# Altium project URESP_PULSER.PrjPcb
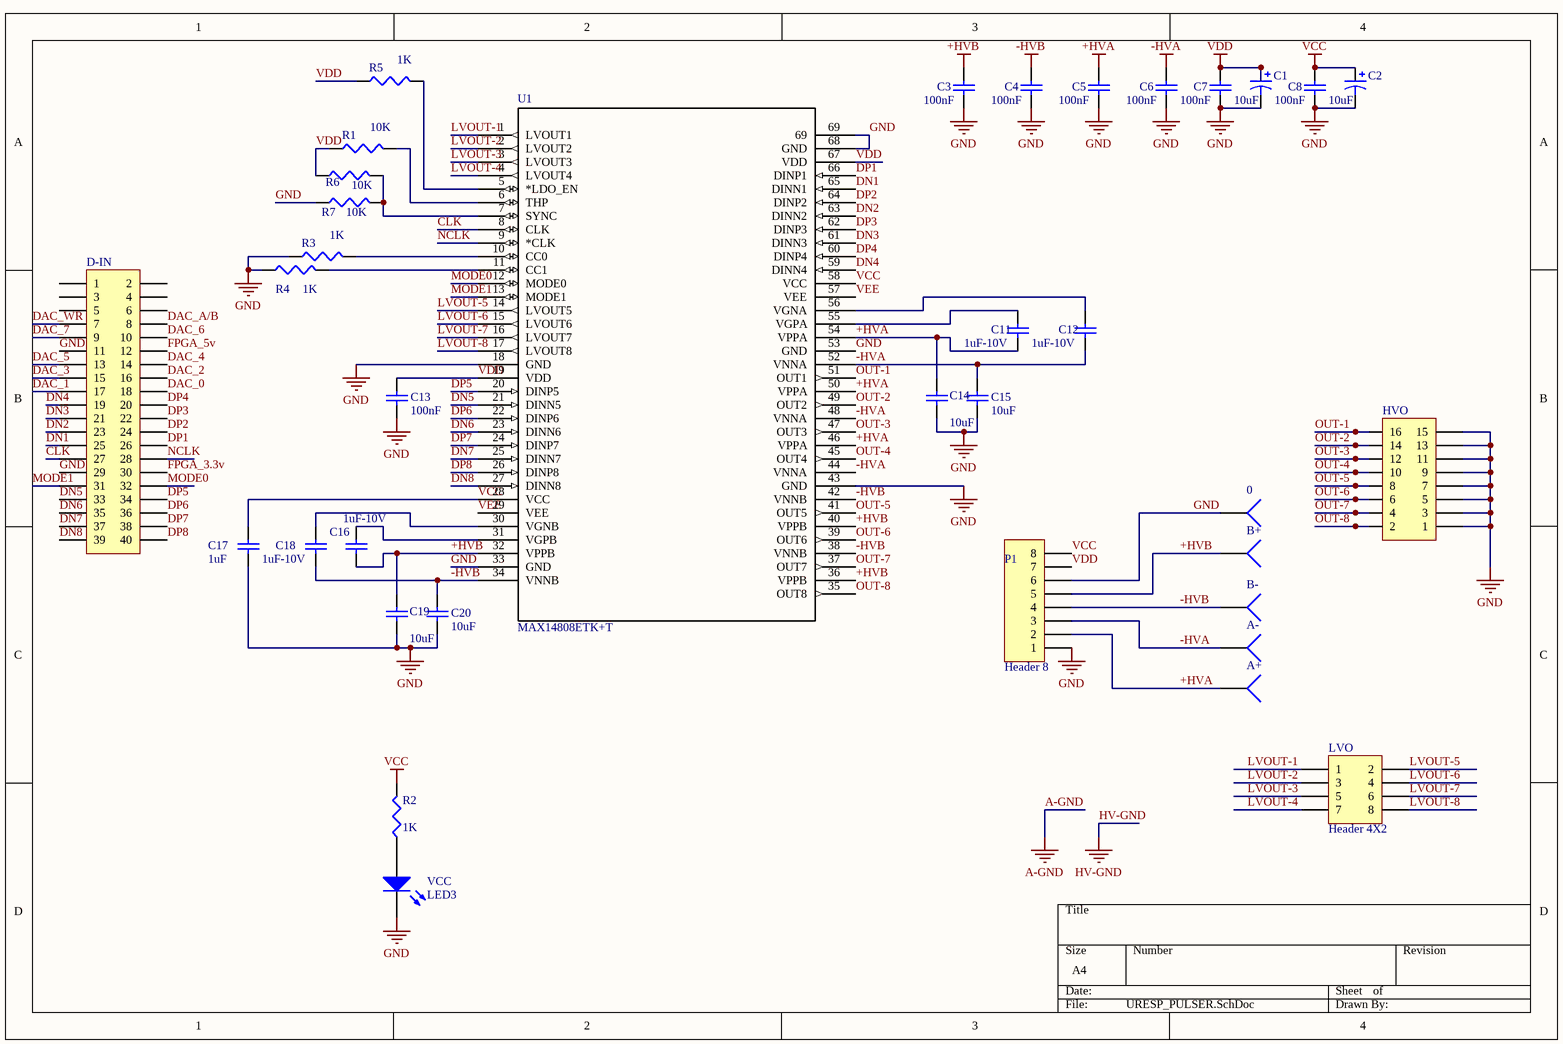
[diagram p0: URESP_PULSER.SchDoc]
2 sheets, 54 parts. Net scope: global (net labels, ports and power ports of the same name join across sheets).
Board file: URESP_PULSER.PcbDoc
Sheets:
  URESP_PULSER.SchDoc
  URESP_PULSER_2.SchDoc

## Sheet URESP_PULSER.SchDoc
size A4

### Parts
0  (no value)  [PIN1]
A+  (no value)  [PIN1]
A-  (no value)  [PIN1]
B+  (no value)  [PIN1]
B-  (no value)  [PIN1]
C1  value 10uF  [C1206]
C2  value 10uF  [C1206]
C3  value 100nF  [6-0805_M]
C4  value 100nF  [6-0805_M]
C5  value 100nF  [6-0805_M]
C6  value 100nF  [6-0805_M]
C7  value 100nF  [1608[0603]]
C8  value 100nF  [1608[0603]]
C11  value 1uF-10V  [1608[0603]]
C12  value 1uF-10V  [1608[0603]]
C13  value 100nF  [1608[0603]]
C14  value 10uF  [CAPPR5-6.3X5]
C15  value 10uF  [CAPPR5-6.3x5]
C16  value 1uF-10V  [1608[0603]]
C17  value 1uF  [1608[0603]]
C18  value 1uF-10V  [1608[0603]]
C19  value 10uF  [CAPPR5-6.3X5]
C20  value 10uF  [CAPPR5-6.3X5]
D-IN  (no value)  [HDR2X20]
HVO  (no value)  [HDR2X8]
LVO  Header 4X2  [HDR2X4]
P1  Header 8  [HDR1X8]
R1  value 10K  [J1-0603]
R2  value 1K  [J1-0603]
R3  value 1K  [J1-0603]
R4  value 1K  [J1-0603]
R5  value 1K  [J1-0603]
R6  value 10K  [J1-0603]
R7  value 10K  [J1-0603]
U1  MAX14808ETK+T  [21-0142E_T6800-2]
VCC  LED3  [6-0805_M]

### Nets
+HVA: A+.1 C5.2 C11.1 C14.1 P1.2 U1.46(VPPA) U1.50(VPPA) U1.54(VPPA)
+HVB: B+.1 C3.2 C16.1 C19.1 P1.5 U1.32(VPPB) U1.36(VPPB) U1.40(VPPB)
-HVA: A-.1 C6.2 C12.1 C15.2 P1.3 U1.44(VNNA) U1.48(VNNA) U1.52(VNNA)
-HVB: B-.1 C4.2 C18.1 C20.2 P1.4 U1.34(VNNB) U1.38(VNNB) U1.42(VNNB)
GND: 0.1 C1.2 C2.2 C3.1 C4.1 C5.1 C6.1 C7.1 C8.1 C13.1 C14.2 C15.1 C17.1 C19.2 C20.1 D-IN.11 D-IN.29 HVO.1 HVO.3 HVO.5 HVO.7 HVO.9 HVO.11 HVO.13 HVO.15 P1.1 P1.6 R3.1 R4.1 R7.1 U1.18(GND) U1.33(GND) U1.43(GND) U1.53(GND) U1.68(GND) U1.69 VCC.2(K)
VCC: C2.1 C8.2 C17.2 P1.8 R2.2 U1.28(VCC) U1.58(VCC)
VDD: C1.1 C7.2 C13.2 P1.7 R1.1 R5.1 R6.1 U1.19(VDD) U1.67(VDD)
CLK: D-IN.27 U1.8(CLK)
DAC_0: D-IN.18
DAC_1: D-IN.17
DAC_2: D-IN.16
DAC_3: D-IN.15
DAC_4: D-IN.14
DAC_5: D-IN.13
DAC_6: D-IN.10
DAC_7: D-IN.9
DAC_A/B: D-IN.8
DAC_WR: D-IN.7
DN1: D-IN.25 U1.65(DINN1)
DN2: D-IN.23 U1.63(DINN2)
DN3: D-IN.21 U1.61(DINN3)
DN4: D-IN.19 U1.59(DINN4)
DN5: D-IN.33 U1.21(DINN5)
DN6: D-IN.35 U1.23(DINN6)
DN7: D-IN.37 U1.25(DINN7)
DN8: D-IN.39 U1.27(DINN8)
DP1: D-IN.26 U1.66(DINP1)
DP2: D-IN.24 U1.64(DINP2)
DP3: D-IN.22 U1.62(DINP3)
DP4: D-IN.20 U1.60(DINP4)
DP5: D-IN.34 U1.20(DINP5)
DP6: D-IN.36 U1.22(DINP6)
DP7: D-IN.38 U1.24(DINP7)
DP8: D-IN.40 U1.26(DINP8)
FPGA_3.3v: D-IN.30
FPGA_5v: D-IN.12
LVOUT-1: LVO.1 U1.1(LVOUT1)
LVOUT-2: LVO.3 U1.2(LVOUT2)
LVOUT-3: LVO.5 U1.3(LVOUT3)
LVOUT-4: LVO.7 U1.4(LVOUT4)
LVOUT-5: LVO.2 U1.14(LVOUT5)
LVOUT-6: LVO.4 U1.15(LVOUT6)
LVOUT-7: LVO.6 U1.16(LVOUT7)
LVOUT-8: LVO.8 U1.17(LVOUT8)
MODE0: D-IN.32 U1.12(MODE0)
MODE1: D-IN.31 U1.13(MODE1)
NCLK: D-IN.28 U1.9(*CLK)
OUT-1: HVO.16 U1.51(OUT1)
OUT-2: HVO.14 U1.49(OUT2)
OUT-3: HVO.12 U1.47(OUT3)
OUT-4: HVO.10 U1.45(OUT4)
OUT-5: HVO.8 U1.41(OUT5)
OUT-6: HVO.6 U1.39(OUT6)
OUT-7: HVO.4 U1.37(OUT7)
OUT-8: HVO.2 U1.35(OUT8)
VEE: U1.29(VEE) U1.57(VEE)
NetC11_2: C11.2 U1.55(VGPA)
NetC12_2: C12.2 U1.56(VGNA)
NetC16_2: C16.2 U1.31(VGPB)
NetC18_2: C18.2 U1.30(VGNB)
NetR1_2: R1.2 U1.6(THP)
NetR2_1: R2.1 VCC.1(A)
NetR3_2: R3.2 U1.10(CC0)
NetR4_2: R4.2 U1.11(CC1)
NetR5_2: R5.2 U1.5(*LDO_EN)
NetR6_2: R6.2 R7.2 U1.7(SYNC)

Not connected (* = marked no-connect by the designer): D-IN 1 2 3 4 5 6

### Library data of the parts
0 A+ A- B+ B- = Socket: LatestRevisionDate: 17-Jul-2002; LatestRevisionNote: Re-released for DXP Platform.; Publisher: Altium Limited
C1 C2 = Cap Pol3: Polarized Capacitor (Surface Mount); Published: 8-Jun-2000; LatestRevisionDate: 29-May-2009; LatestRevisionNote: IPC-7351 Footprint Added.; PackageReference: C0805; Publisher: Altium Limited; PackageDescription: Chip Capacitor
C3-C8 C11-C20 = Cap Semi: Capacitor (Semiconductor SIM Model); Published: 8-Jun-2000; LatestRevisionDate: 29-May-2009; LatestRevisionNote: IPC-7351 Footprint Added.; PackageReference: C1206; Publisher: Altium Limited; PackageDescription: Chip Capacitor
D-IN = Header 20X2: Header, 20-Pin, Dual row; LatestRevisionDate: 17-Jul-2002; LatestRevisionNote: Re-released for DXP Platform.; Publisher: Altium Limited
HVO = Header 8X2H: Header, 8-Pin, Dual row, Right Angle; LatestRevisionDate: 17-Jul-2002; LatestRevisionNote: Re-released for DXP Platform.; Publisher: Altium Limited
LVO = Header 4X2: Header, 4-Pin, Dual row; LatestRevisionDate: 17-Jul-2002; LatestRevisionNote: Re-released for DXP Platform.; Publisher: Altium Limited
P1 = Header 8: Header, 8-Pin; LatestRevisionDate: 17-Jul-2002; LatestRevisionNote: Re-released for DXP Platform.; Publisher: Altium Limited
R1-R7 = Res3: Resistor; Published: 8-Jun-2000; LatestRevisionDate: 29-May-2009; LatestRevisionNote: IPC-7351 Footprint Added.; PackageReference: J1-0603; Publisher: Altium Limited; PackageDescription: Chip Resistor
U1 = MAX14808ETK+T: Imported; Vendor: Maxim; Manufacturer_Part_Number: MAX14808ETK+T; Manufacturer_Name: Maxim; RefDes: RefDes; Type: DEV; Value: Value
VCC = LED3: Typical BLUE SiC LED; Published: 8-Jun-2000; LatestRevisionDate: 17-Dec-2003; LatestRevisionNote: PCB Footprint replaced.; DatasheetVersion: 16-Apr-2002; PackageVersion: 16-Apr-2002; PackageReference: 3.5X2.8X1.9; Publisher: Altium Limited; PackageDescription: SM LED; 2 C-Bend Leads; Body 3.5 x 2.8 x 1.9 mm, inc leads (LxWxH typ)

## Sheet URESP_PULSER_2.SchDoc
size A4
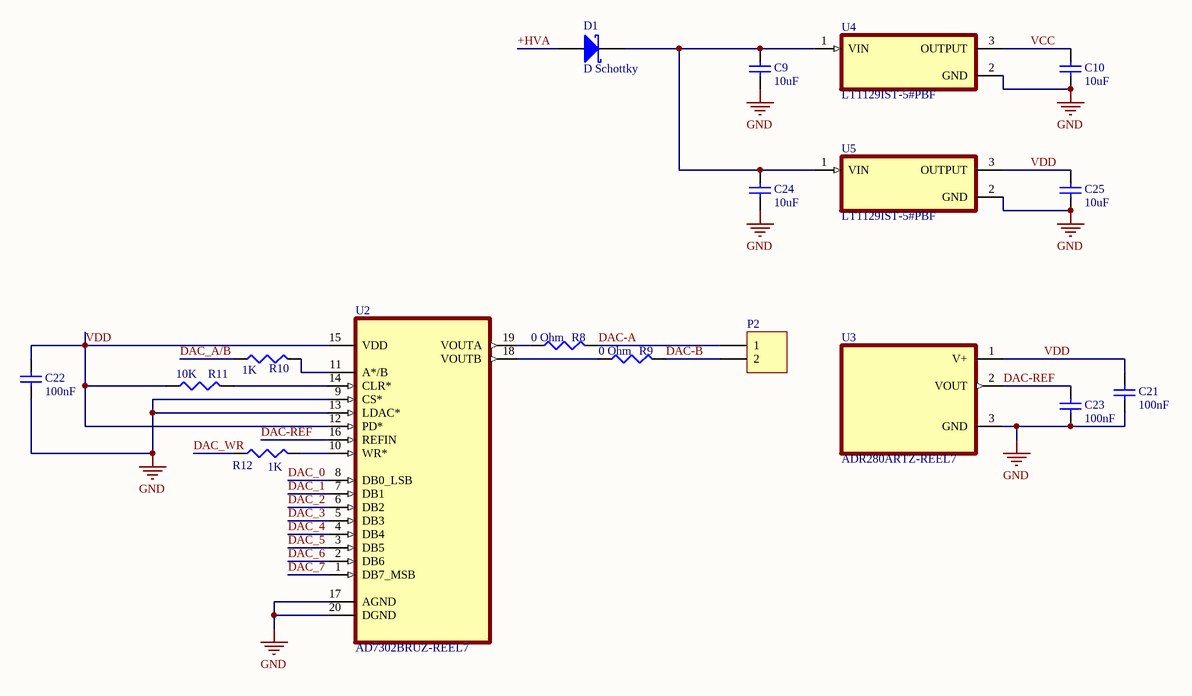
[diagram p1: URESP_PULSER_2.SchDoc]

### Parts
C9  value 10uF  [6-0805_L]
C10  value 10uF  [6-0805_L]
C21  value 100nF  [1608[0603]]
C22  value 100nF  [1608[0603]]
C23  value 100nF  [1608[0603]]
C24  value 10uF  [6-0805_L]
C25  value 10uF  [6-0805_L]
D1  D Schottky  [C1206]
P2  (no value)  [HDR1X2]
R8  value 0 Ohm  [J1-0603]
R9  value 0 Ohm  [J1-0603]
R10  value 1K  [J1-0603]
R11  value 10K  [J1-0603]
R12  value 1K  [J1-0603]
U2  AD7302BRUZ-REEL7  [SOP65P637X110-20N]
U3  ADR280ARTZ-REEL7  [SOT96P237X112-3N]
U4  LT1129IST-5#PBF  [SOT230P700X180-4N]
U5  LT1129IST-5#PBF  [SOT230P700X180-4N]

### Nets
+HVA: D1.1(A)
GND: C9.1 C10.1 C21.1 C22.1 C23.1 C24.1 C25.1 U2.9(CS*) U2.13(LDAC*) U2.17(AGND) U2.20(DGND) U3.3(GND) U4.2(GND) U5.2(GND)
VCC: C10.2 U4.3(OUTPUT)
VDD: C21.2 C22.2 C25.2 R11.1 U2.12(PD*) U2.15(VDD) U3.1(V+) U5.3(OUTPUT)
DAC-A: P2.1 R8.2
DAC-B: P2.2 R9.2
DAC-REF: C23.2 U2.16(REFIN) U3.2(VOUT)
DAC_0: U2.8(DB0_LSB)
DAC_1: U2.7(DB1)
DAC_2: U2.6(DB2)
DAC_3: U2.5(DB3)
DAC_4: U2.4(DB4)
DAC_5: U2.3(DB5)
DAC_6: U2.2(DB6)
DAC_7: U2.1(DB7_MSB)
DAC_A/B: R10.1
DAC_WR: R12.1
NetC9_2: C9.2 C24.2 D1.2(K) U4.1(VIN) U5.1(VIN)
NetR8_1: R8.1 U2.19(VOUTA)
NetR9_1: R9.1 U2.18(VOUTB)
NetR10_2: R10.2 U2.11(A*/B)
NetR11_2: R11.2 U2.14(CLR*)
NetR12_2: R12.2 U2.10(WR*)

### Library data of the parts
C9 C10 C21-C25 = Cap Semi: Capacitor (Semiconductor SIM Model); Published: 8-Jun-2000; LatestRevisionDate: 29-May-2009; LatestRevisionNote: IPC-7351 Footprint Added.; PackageReference: C1206; Publisher: Altium Limited; PackageDescription: Chip Capacitor
D1 = D Schottky: Schottky Diode; Published: 8-Jun-2000; LatestRevisionDate: 17-Jul-2002; LatestRevisionNote: Re-released for DXP Platform.; PackageReference: SMB; Publisher: Altium Limited; PackageDescription: DO-214-AA/SMB; 2 C-Bend Leads; Body 5.3 x 3.6 mm, inc. leads (LxW); Code_JEDEC: DO-214-AA
P2 = Header 2: Header, 2-Pin; LatestRevisionDate: 17-Jul-2002; LatestRevisionNote: Re-released for DXP Platform.; Publisher: Altium Limited
R8-R12 = Res3: Resistor; Published: 8-Jun-2000; LatestRevisionDate: 29-May-2009; LatestRevisionNote: IPC-7351 Footprint Added.; PackageReference: J1-0603; Publisher: Altium Limited; PackageDescription: Chip Resistor
U2 = AD7302BRUZ-REEL7: 8-Bit Digital-to-Analog Converters; MF: {'manufacturer': u'Analog Devices'}; Availability: Unavailable; MP: AD7302BRUZ-REEL7; Package: None; Price: None; Value: *
U3 = ADR280ARTZ-REEL7: MF: {'manufacturer': u'Analog Devices'}; Availability: Unavailable; MP: ADR280ARTZ-REEL7; Package: None; Price: None; Value: *
U4 U5 = LT1129IST-5#PBF: MF: {'manufacturer': u'Analog Devices'}; Availability: Unavailable; Price: None; Value: *; MP: LT1129IST-5#PBF; Package: None

## Nets that join several sheets
+HVA: URESP_PULSER (8 pins), URESP_PULSER_2 (D1.1)
GND: URESP_PULSER (37 pins), URESP_PULSER_2 (14 pins)
VCC: URESP_PULSER (7 pins), URESP_PULSER_2 (C10.2 U4.3)
VDD: URESP_PULSER (9 pins), URESP_PULSER_2 (8 pins)
DAC_0: URESP_PULSER (D-IN.18), URESP_PULSER_2 (U2.8)
DAC_1: URESP_PULSER (D-IN.17), URESP_PULSER_2 (U2.7)
DAC_2: URESP_PULSER (D-IN.16), URESP_PULSER_2 (U2.6)
DAC_3: URESP_PULSER (D-IN.15), URESP_PULSER_2 (U2.5)
DAC_4: URESP_PULSER (D-IN.14), URESP_PULSER_2 (U2.4)
DAC_5: URESP_PULSER (D-IN.13), URESP_PULSER_2 (U2.3)
DAC_6: URESP_PULSER (D-IN.10), URESP_PULSER_2 (U2.2)
DAC_7: URESP_PULSER (D-IN.9), URESP_PULSER_2 (U2.1)
DAC_A/B: URESP_PULSER (D-IN.8), URESP_PULSER_2 (R10.1)
DAC_WR: URESP_PULSER (D-IN.7), URESP_PULSER_2 (R12.1)